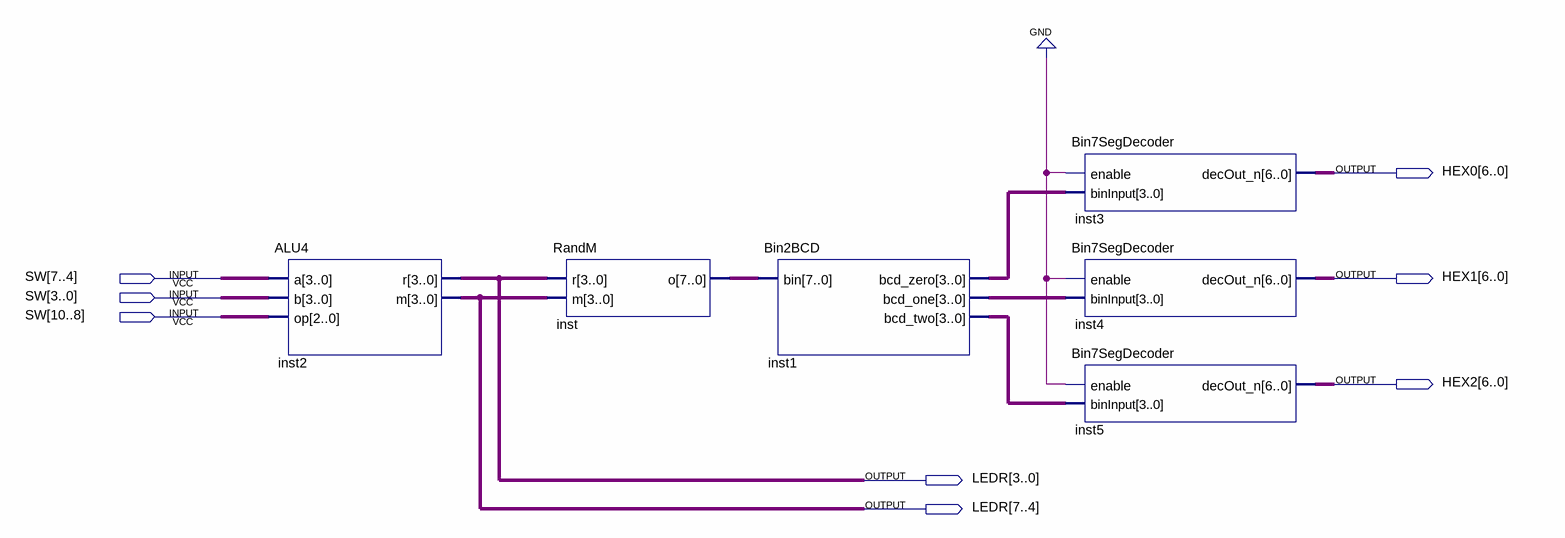
[diagram p0: schematic sheet]
// Quartus schematic ALUDemo.bdf as structural Verilog: 6 symbols, 8 pins
module ALUDemo (
  input  [10:0] SW,
  output [6:0] HEX0,
  output [6:0] HEX1,
  output [6:0] HEX2,
  output [7:0] LEDR
);

  wire [3:0] inst1_bcd_one, inst1_bcd_two, inst1_bcd_zero;
  wire [7:0] inst_o;

  ALU4 inst2 (.a(SW[7:4]), .b(SW[3:0]), .op(SW[10:8]), .r(LEDR[3:0]), .m(LEDR[7:4]));
  RandM inst (.r(LEDR[3:0]), .m(LEDR[7:4]), .o(inst_o));
  Bin2BCD inst1 (.bin(inst_o), .bcd_zero(inst1_bcd_zero), .bcd_one(inst1_bcd_one), .bcd_two(inst1_bcd_two));
  Bin7SegDecoder inst3 (.enable(1'b0), .binInput(inst1_bcd_zero), .decOut_n(HEX0));
  Bin7SegDecoder inst4 (.enable(1'b0), .binInput(inst1_bcd_one), .decOut_n(HEX1));
  Bin7SegDecoder inst5 (.enable(1'b0), .binInput(inst1_bcd_two), .decOut_n(HEX2));
endmodule
